# EAGLE design Mini-32BOT Rev.A (EAGLE 9.5.2)
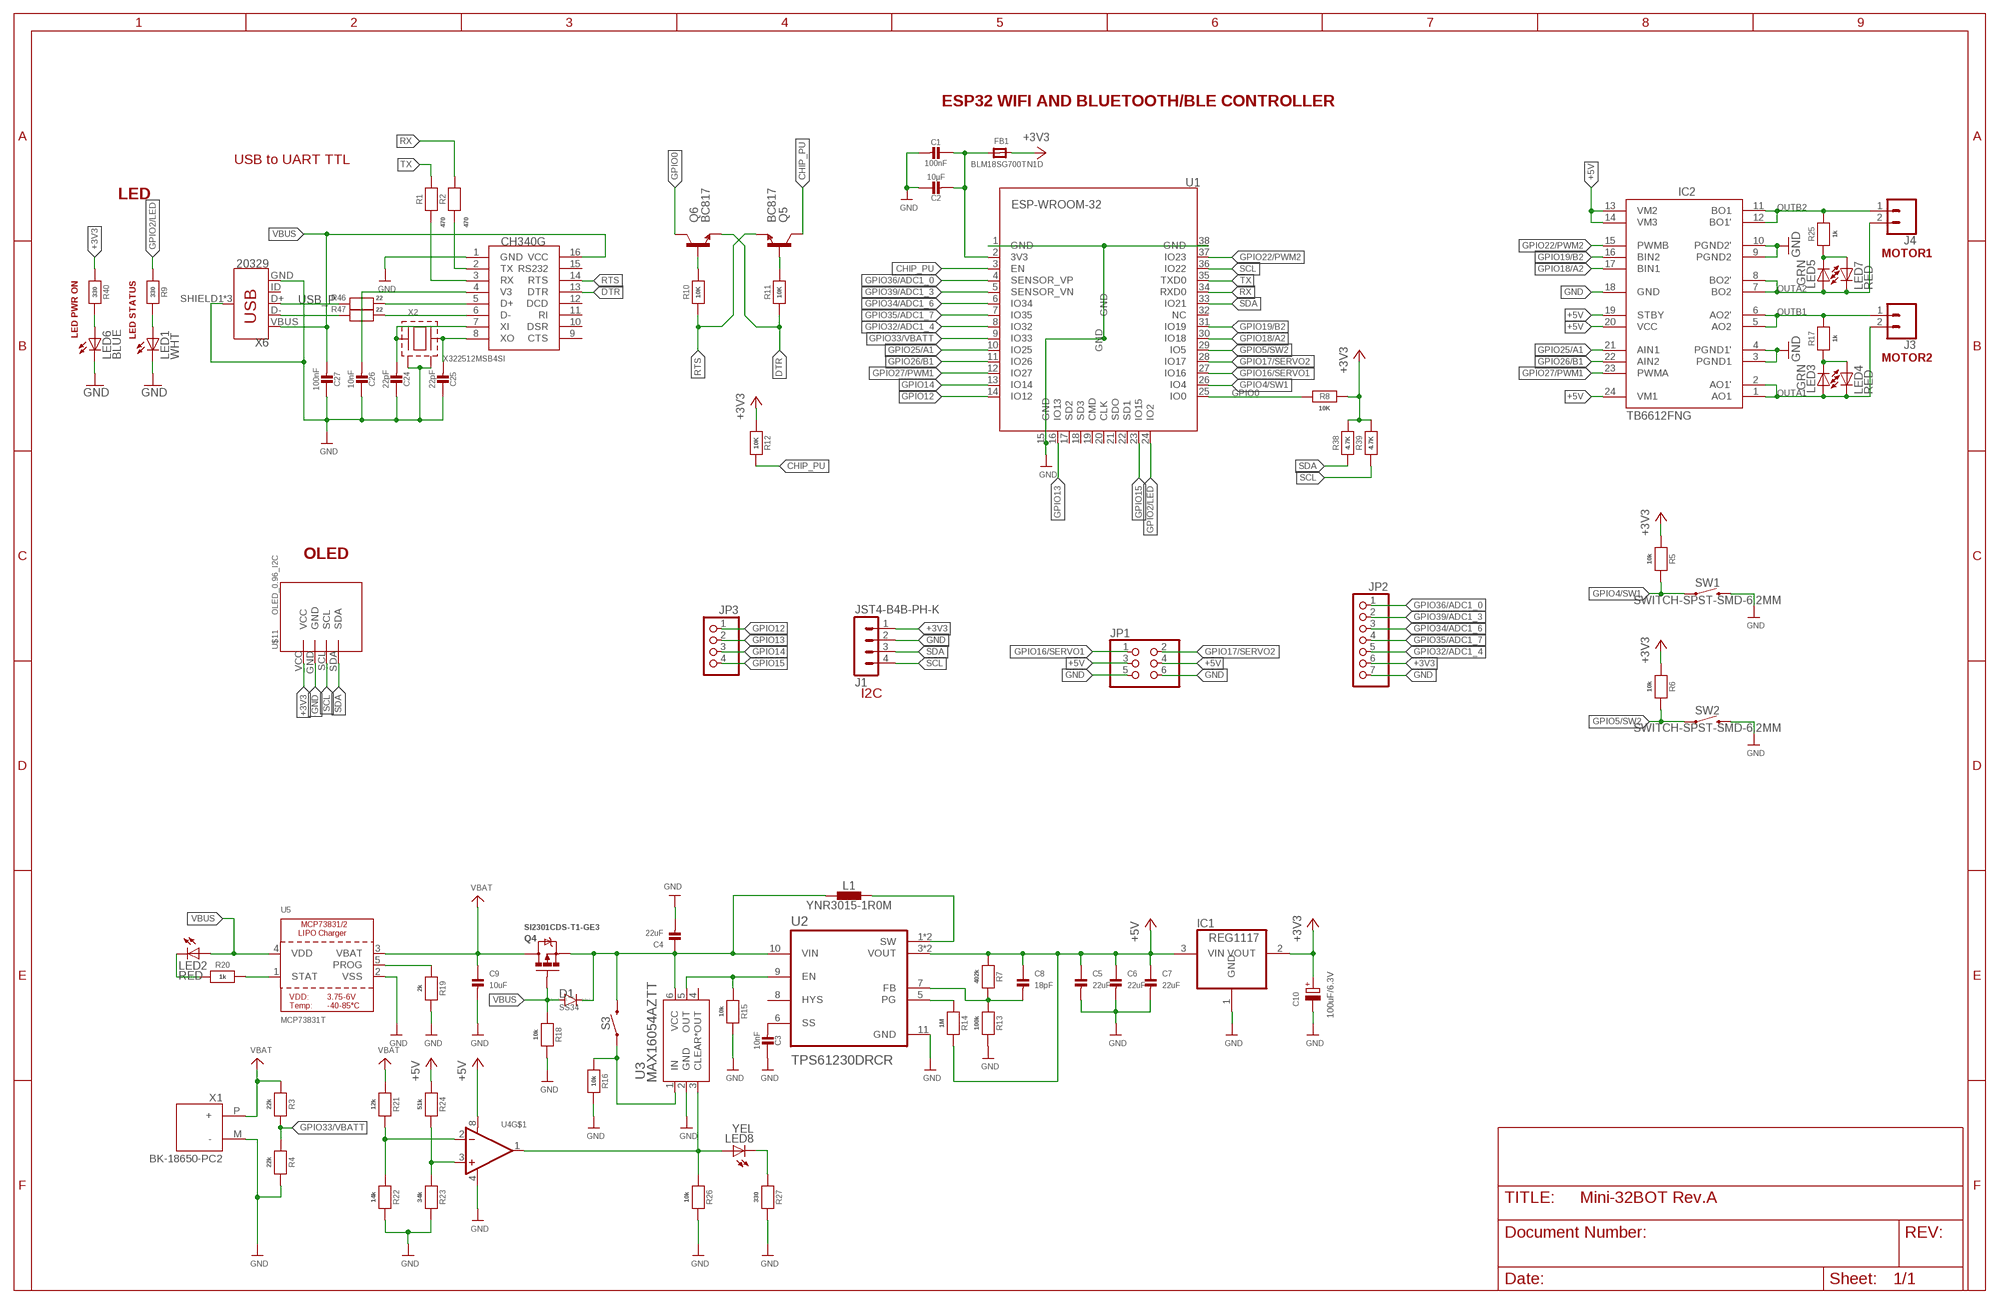
[diagram p0: schematic, sheet 1]

## Parts
C1  100nF  CAP_CERAMIC0603  [0603]
C2  10µF  CAP_CERAMIC0805  [0805]
C3  10nF  CAP_CERAMIC0603  [0603]
C4  22uF  CAP_CERAMIC0805  [0805]
C5  22uF  CAP_CERAMIC0805  [0805]
C6  22uF  CAP_CERAMIC0805  [0805]
C7  22uF  CAP_CERAMIC0805  [0805]
C8  18pF  CAP_CERAMIC0603  [0603]
C9  10uF  CAP_CERAMIC0805  [0805]
C10  100uF/6.3V  CPOL-EUCT3528  [CT3528]
C24  22pF  CAP_CERAMIC0603  [0603]
C25  22pF  CAP_CERAMIC0603  [0603]
C26  10nF  CAP_CERAMIC0603  [0603]
C27  100nF  CAP_CERAMIC0603  [0603]
D1  SS34  DIODE-DO-214AC  [DO-214AC]
FB1  BLM18SG700TN1D  FERRITE_0603  [_0603]
IC1  REG1117  [SOT223]
IC2  TB6612FNG  [SSOP24]
J1  JST4-B4B-PH-K  [JST_B4B-PH-K]
J3  CONN_023.5MM  [SCREWTERMINAL-3.5MM-2]
J4  CONN_023.5MM  [SCREWTERMINAL-3.5MM-2]
JP1  PINHD-2X03_2.54  [2X03]
JP2  PINHD-1X07_2.54-S  [1X07-S]
JP3  PINHD-1X04_2.54-S  [1X04-S]
L1  YNR3015-1R0M  INDUCTOR-NR40XX  [L_NR40XX]
LED1  WHT  LEDCHIP-LED0805  [CHIP-LED0805]
LED2  RED  LEDCHIP-LED0805  [CHIP-LED0805]
LED3  GRN  LEDCHIP-LED0805  [CHIP-LED0805]
LED4  RED  LEDCHIP-LED0805  [CHIP-LED0805]
LED5  GRN  LEDCHIP-LED0805  [CHIP-LED0805]
LED6  BLUE  LEDCHIP-LED0805  [CHIP-LED0805]
LED7  RED  LEDCHIP-LED0805  [CHIP-LED0805]
LED8  YEL  LEDCHIP-LED0805  [CHIP-LED0805]
Q4  SI2301CDS-T1-GE3  MOSFET-PCHANNELDMG2307L  [SOT23-3]
Q5  BC817  TRANSISTOR_NPNSOT23-3  [SOT23-3]
Q6  BC817  TRANSISTOR_NPNSOT23-3  [SOT23-3]
R1  470  RESISTOR0603  [0603]
R2  470  RESISTOR0603  [0603]
R3  22k  RESISTOR0603  [0603]
R4  22k  RESISTOR0603  [0603]
R5  10k  RESISTOR0603  [0603]
R6  10k  RESISTOR0603  [0603]
R7  402k  RESISTOR0603  [0603]
R8  10K  RESISTOR0603  [0603]
R9  330  RESISTOR0603  [0603]
R10  10K  RESISTOR0603  [0603]
R11  10K  RESISTOR0603  [0603]
R12  10K  RESISTOR0603  [0603]
R13  100k  RESISTOR0603  [0603]
R14  1M  RESISTOR0603  [0603]
R15  10k  RESISTOR0603  [0603]
R16  10k  RESISTOR0603  [0603]
R17  1k  RESISTOR0603  [0603]
R18  10k  RESISTOR0603  [0603]
R19  2k  RESISTOR0603  [0603]
R20  1k  RESISTOR0603  [0603]
R21  12k  RESISTOR0603  [0603]
R22  14k  RESISTOR0603  [0603]
R23  34k  RESISTOR0603  [0603]
R24  51k  RESISTOR0603  [0603]
R25  1k  RESISTOR0603  [0603]
R26  10k  RESISTOR0603  [0603]
R27  330  RESISTOR0603  [0603]
R38  4.7K  RESISTOR0603  [0603]
R39  4.7K  RESISTOR0603  [0603]
R40  330  RESISTOR0603  [0603]
R46  22  RESISTOR0603  [0603]
R47  22  RESISTOR0603  [0603]
S3  MOMENTARY-SWITCH-SPST-PTH-RIGHT-ANGLE-KIT  [TACTILE_SWITCH_PTH_RIGHT_ANGLE_KIT]
SW1  SWITCH-SPST-SMD-6.2MM  MOMENTARY-SWITCH-SPST-SMD-6.2MM-TALL  [TACTILE_SWITCH_SMD_6.2MM_TALL]
SW2  SWITCH-SPST-SMD-6.2MM  MOMENTARY-SWITCH-SPST-SMD-6.2MM-TALL  [TACTILE_SWITCH_SMD_6.2MM_TALL]
U1  ESP-WROOM-32  [ESP-WROOM-32]
U2  TPS61230DRCR  [SON50P300X300X100-11N]
U3  MAX16054AZTT  [21-0114C]
U4  LM358  [SOIC8_150MIL]
U5  MCP73831T  MCP73831/2  [SOT23-5]
U$11  OLED_0.96_I2C  [OLED_0.96_I2C]
U$24  CH340G  [SOIC16]
X1  BK-18650-PC2  [MPD_BK-18650-PC2]
X2  X322512MSB4SI  306010049_XTAL_16MHZ-3225_4P  [X3225_4P]
X6  20329  USB_MICRO-B_FEMALE-SMT  [USB-B-MICRO-SMD]

## Nets
3V3: C1.1 C2.2 FB1.1 U1.2(3V3)
+3V3: C10.+ FB1.2 IC1.2(VOUT) J1.1 JP2.6 R5.1 R6.1 R8.2 R12.1 R38.2 R39.2 R40.1 U$11.VCC
+5V: C5.1 C6.1 C7.1 C8.1 IC1.3(VIN) IC2.13(VM2) IC2.14(VM3) IC2.19(STBY) IC2.20(VCC) IC2.24(VM1) JP1.3 JP1.4 R7.1 R14.2 R24.1 U2.3(VOUT) U2.4(VOUT) U4.8(V+)
CHIP_PU: Q5.3(C) R12.2 U1.3(EN)
DTR: Q6.2(E) R11.1 U$24.13(DTR)
GND: C1.2 C2.1 C3.1 C4.2 C5.2 C6.2 C7.2 C9.2 C10.- C24.1 C25.1 C26.1 C27.1 IC1.1(GND) IC2.3(PGND1) IC2.4(PGND1') IC2.9(PGND2) IC2.10(PGND2') IC2.18(GND) J1.2 JP1.5 JP1.6 JP2.7 LED1.C LED6.C R4.2 R13.2 R15.2 R16.2 R18.2 R19.2 R22.2 R23.2 R26.2 R27.2 SW1.B2 SW2.B2 U1.1(GND) U1.15(GND) U1.38(GND) U1.GND U2.11(GND) U3.2(GND) U4.4(V-) U5.2(VSS) U$11.GND U$24.1(GND) X1.M(-) X2.P$2(GND1) X2.P$4(GND2) X6.GND X6.SHIELD1(SHIELD) X6.SHIELD2(SHIELD) X6.SHIELD3(SHIELD)
GPIO0: Q6.3(C) R8.1 U1.25(IO0)
GPIO2/LED: R9.1 U1.24(IO2)
GPIO4/SW1: R5.2 SW1.A2 U1.26(IO4)
GPIO5/SW2: R6.2 SW2.A2 U1.29(IO5)
GPIO12: JP3.1 U1.14(IO12)
GPIO13: JP3.2 U1.16(IO13)
GPIO14: JP3.3 U1.13(IO14)
GPIO15: JP3.4 U1.23(IO15)
GPIO16/SERVO1: JP1.1 U1.27(IO16)
GPIO17/SERVO2: JP1.2 U1.28(IO17)
GPIO18/A2: IC2.17(BIN1) U1.30(IO18)
GPIO19/B2: IC2.16(BIN2) U1.31(IO19)
GPIO22/PWM2: IC2.15(PWMB) U1.37(IO23)
GPIO25/A1: IC2.21(AIN1) U1.10(IO25)
GPIO26/B1: IC2.22(AIN2) U1.11(IO26)
GPIO27/PWM1: IC2.23(PWMA) U1.12(IO27)
GPIO32/ADC1_4: JP2.5 U1.8(IO32)
GPIO33/VBATT: R3.2 R4.1 U1.9(IO33)
GPIO34/ADC1_6: JP2.3 U1.6(IO34)
GPIO35/ADC1_7: JP2.4 U1.7(IO35)
GPIO36/ADC1_0: JP2.1 U1.4(SENSOR_VP)
GPIO39/ADC1_3: JP2.2 U1.5(SENSOR_VN)
N$1: C4.1 D1.C L1.1 Q4.2(S) S3.2 U2.10(VIN) U3.6(VCC)
N$2: C3.2 U2.6(SS)
N$3: L1.2 U2.1(SW) U2.2(SW)
N$4: R15.1 U2.9(EN) U3.5(OUT)
N$5: C8.2 R7.2 R13.1 U2.7(FB)
N$6: R14.1 U2.5(PG)
N$7: R16.1 S3.1 U3.1(IN)
N$8: R21.2 R22.1 U4.2(-IN)
N$9: R23.1 R24.2 U4.3(+IN)
N$10: LED8.A R26.1 U3.3(CLEAR) U4.1(OUT)
N$11: LED3.C LED4.A R17.1
N$12: LED5.C LED7.A R25.1
N$13: R19.1 U5.5(PROG)
N$14: C25.2 U$24.8(XO) X2.P$3
N$15: LED2.C R20.1
N$16: R20.2 U5.1(STAT)
N$17: C24.2 U$24.7(XI) X2.P$1
N$22: LED8.C R27.1
N$23: LED1.A R9.2
N$35: LED6.A R40.2
N$38: Q5.1(B) R11.2
N$40: C26.2 U$24.4(V3)
N$41: Q6.1(B) R10.2
N$52: R2.1 U$24.2(TX)
N$53: R1.1 U$24.3(RX)
N$64: R46.1 U$24.5(D+)
N$65: R47.1 U$24.6(D-)
OUTA1: IC2.1(AO1) IC2.2(AO1') J3.2 LED3.A LED4.C
OUTA2: IC2.7(BO2) IC2.8(BO2') J4.2 LED5.A LED7.C
OUTB1: IC2.5(AO2) IC2.6(AO2') J3.1 R17.2
OUTB2: IC2.11(BO1) IC2.12(BO1') J4.1 R25.2
RTS: Q5.2(E) R10.1 U$24.14(RTS)
RX: R2.2 U1.34(RXD0)
SCL: J1.4 R39.1 U1.36(IO22) U$11.SCL
SDA: J1.3 R38.1 U1.33(IO21) U$11.SDA
TX: R1.2 U1.35(TXD0)
USB_N: R47.2 X6.D-
USB_P: R46.2 X6.D+
VBAT: C9.1 Q4.3(D) R3.1 R21.1 U5.3(VBAT) X1.P(+)
VBUS: C27.2 D1.A LED2.A Q4.1(G) R18.1 U5.4(VDD) U$24.16(VCC) X6.VBUS
Unconnected: U1.17(SD2) U1.18(SD3) U1.19(CMD) U1.20(CLK) U1.21(SDO) U1.22(SD1) U1.32(NC) U2.8(HYS) U3.4(*OUT) U4.5(+IN) U4.6(-IN) U4.7(OUT) U$24.9(CTS) U$24.10(DSR) U$24.11(RI) U$24.12(DCD) U$24.15(RS232) X6.ID

## Notes on the sheet
- ESP32 WIFI AND BLUETOOTH/BLE CONTROLLER
- USB to UART TTL
- LED
- MOTOR1
- LED PWR ON | LED STATUS
- MOTOR2
- OLED
- I2C

## Library data of the parts
C1-C9 C24-C27 = microbuilder:CAP_CERAMIC: Ceramic Capacitors 0402 - 0402 Surface Mount Capacitors 16pF 50V 5% [Digikey: 445-4899-2-ND] 18pF 50V 5% [Digikey: 490-1281-2-ND] 22pF 50V 5% [Digikey: 490-1283-2-ND] 68pF 50V 5% [Digikey: 490-1289-2-ND] 0.1uF 10V 10% [Digikey: 490-1318-2-ND] 1.0uF 6.3V 10% [Digikey: 490-1320-2-ND] 0603 - 0603 Surface Mount Capacitors 16 pF 50V 5% [Digikey: 445-5051-2-ND] 22 pF 50V [Digikey: PCC220ACVTR-ND] 33 pF 50V 5% [Digikey: 490-1415-1-ND] 56pF 50V 5% [Digikey: 490-1421-1-ND] 220pF 50V 5% [Digikey: 445-1285-1-ND] 680 pF 50V 2200 pF 50V 5% C0G [Digikey: 445-1297-1-ND] 5600 pF 100V 5% X7R [Digikey: 478-3711-1-ND] 0.1 µF 25V 10% [Digikey: PCC2277TR-ND] 0.22 µF 16V 10% X7R [Digikey: 445-1318-1-ND] 1.0 µF 25V 10% [Digikey: 445-5146-2-ND] 0603 - RF Specific 3pF 250V +/-0.1pF RF [Digikey: 712-1347-1-ND] 18 pF 250V 5% [Digikey: 478-3505-1-ND or 712-1322-1-ND] 56 pF 250V 5% C0G RF [Digikey: 490-4867-1-ND] 68 pF 250V RF [Digikey: 490-4868-1-ND] 0805 - 0805 Surface Mount Capacitors 220 pF 250V 2% RF Ceramic Capacitor [Digikey: 712-1398-1-ND] 1000 pF 50V 2% NP0 Ceramic Capacitor [Digikey: 478-3760-1-ND] 0.1 µF 25V 10% Ceramic Capacitor [Digikey: PCC1828TR-ND] 1.0 µF 16V 10% Ceramic Capacitor[Digikey: 490-1691-2-ND] 10.0 µF 10V 10% Ceramic Capacitor[Digikey: 709-1228-1-ND] 10.0 uF 16V 10% Ceramic Capacitor [Digikey: 478-5165-2-ND] 47 uF 6.3V 20% Ceramic Capacitor [Digikey: 587-1779-1-ND or 399-5506-1-ND] 1206 - 1206 Surface Mount Capacitors 47uF 10V 20% Ceramic Capacitor [Digikey: 490-5528-1-ND or 399-5508-1-ND or 445-6010-1-ND] 100uF 6.3V -20%, +80% Y5V Ceramic Capacitor (Digikey: 490-4512-1-ND, Mouser: 81-GRM31CF50J107ZE1L)
C10 = rcl:CPOL-EU: POLARIZED CAPACITOR, European symbol; SPICEPREFIX: C
D1 = diode:DIODE-: DIODE
FB1 = microbuilder:FERRITE: Ferrite Bead 0603 MMZ1608B121C - 120 Ohm @ 100MHz, 600mA, 0.15 Ohm DC Resistance - Digikey: 445-2164-1-ND BK1608HW121-T - 120 Ohm, 600mA Ferrite Chip - Digikey: 587-1876-2-ND 0805 HZ0805B272R-10 - 2.7K Ohm @ 100MHz, 200mA, 0.8 Ohm DC Resistance - Digikey: 240-2504-1-ND (see also Murata BLM21BD272SN1L) MMZ2012Y152B - 1.5K Ohm @ 100MHz, 500mA, 0.4 Ohm DC Resistance - Digikey: 445-1560-1-ND - Mainly for high frequency (80-400MHz) MMZ2012R102A - 1K Ohm @ 100MHz, 500mA, 0.3 Ohm DC Resistance - Digikey: 445-1555-2-ND - More general purpose (10-200MHz)
IC1 = burr-brown:REG1117: 800mA and 1A Low Dropout (LDO) Positive Regulator 1.8V, 2.5V, 2.85V, 3.3V, 5V, and Adj; MPN: REG1117; OC_FARNELL: 1097566; OC_NEWARK: 14P6981
IC2 = adafruit:TB6612FNG: TB6612FNG MOS dual H-bridge motor driver, 1.2A current 3.2A peak 3 or 5v logic and 3-15v motor
J1 = we-con:JST4: JST Connector
J3 J4 = SparkFun-Retired:CONN_02: Multi connection point. Often used as Generic Header-pin footprint for 0.1 inch spaced/style header connections On any of the 0.1 inch spaced packages, you can populate with these: Break Away Headers - Straight <https://www.sparkfun.com/products/116> (PRT-00116) Break Away Male Headers - Right Angle <https://www.sparkfun.com/products/553> (PRT-00553) Female Headers <https://www.sparkfun.com/products/115> (PRT-00115) Break Away Headers - Machine Pin <https://www.sparkfun.com/products/117> (PRT-00117) Break Away Female Headers - Swiss Machine Pin <https://www.sparkfun.com/products/743> (PRT-00743) For SCREWTERMINALS and SPRING TERMINALS visit here: Screw Terimnals on SparkFun.com <https://www.sparkfun.com/search/results?term=Screw+Terminals> (5mm/3.5mm/2.54mm spacing) This device is also useful as a general connection point to wire up your design to another part of your project. Our various solder wires solder well into these plated through hole pads. Hook-Up Wire - Assortment (Stranded, 22 AWG) <https://www.sparkfun.com/products/11375> (PRT-11375) Hook-Up Wire - Assortment (Solid Core, 22 AWG) <https://www.sparkfun.com/products/11367> (PRT-11367) View the entire wire category on our website here <https://www.sparkfun.com/categories/141> Special notes: Molex polarized connector foot print use with: PRT-08233 with associated crimp pins and housings. 2.54_SCREWTERM for use with PRT-10571. 3.5mm Screw Terminal footprints for PRT-08084 5mm Screw Terminal footprints for use with PRT-08432; PROD_ID: CONN-08399
JP1 = pinhead-2:PINHD-2X03: PIN HEADER
JP2 = pinhead-2:PINHD-1X07: PIN HEADER
JP3 = pinhead-2:PINHD-1X04: PIN HEADER
L1 = we-power:INDUCTOR: Power Inductor Taiyo Yuden NR4018 NR4018T1R0N - 1.0uH, Ir=4.0A NR4018T2R2N - 2.2uH, Ir=2.7A NR4018T3R3N - 3.3uH, Ir=2.0A NR4018T4R5N - 4.7uH, Ir=1.7A NR4018T6R8N - 6.8uH, Ir=1.4A NR4018T100M - 10uH, Ir=1.2A NR4018T150M - 15uH, Ir=0.94A NR4018T220M - 22uH, Ir=0.80A NR4018T330M - 33uH, Ir=0.65A NR4018T470M - 47uH, Ir=0.57A NR4018T680M - 68uH, Ir=0.47A NR4018T101M - 100uH, Ir=0.40A Taiyo Yuden NR6028 NR6028T0R9N - 0.9uH, Ir=6.6A NR6028T1R5N - 1.5uH, Ir=5.0A NR6028T2R2N - 2.2uH, Ir=4.2A NR6028T3R0N - 3.0uH, Ir=3.6A NR6028T4R7M - 4.7uH, Ir=2.7A NR6028T6R0M - 6.0uH, Ir=2.5A NR6028T100M - 10uH, Ir=1.9A NR6028T150M - 15uH, Ir=1.6A NR6028T220M - 22uH, Ir=1.3A NR6028T330M - 33uH, Ir=1.1A NR6028T470M - 47uH, Ir=0.95A NR6028T680M - 68uH, Ir=0.76A NR6028T101M - 100uH, Ir=0.62A Taiyo Yuden NR6045 NR6045T1R0N - 1.0uH, Ir=8.5A NR6045T1R3N - 1.3uH, Ir=8.0A NR6045T1R8N - 1.8uH, Ir=7.0A NR6045T2R3N - 2.3uH, Ir=6.0A NR6045T3R0N - 3.0uH, Ir=5.0A NR6045T4R5M - 4.5uH, Ir=4.0A NR6045T6R3M - 6.3uH, Ir=3.8A NR6045T100M - 10uH, Ir=3.0A NR6045T150M - 15uH, Ir=2.3A NR6045T220M - 22uH, Ir=1.9A NR6045T330M - 33uH, Ir=1.5A NR6045T470M - 47uH, Ir=1.3A NR6045T680M - 68uH, Ir=1.0A NR6045T101M - 100uH, Ir=0.8A
LED1-LED8 = led:LED: LED OSRAM: - CHIPLED LG R971, LG N971, LY N971, LG Q971, LY Q971, LO R971, LY R971 LH N974, LH R974 LS Q976, LO Q976, LY Q976 LO Q996 - Hyper CHIPLED LW Q18S LB Q993, LB Q99A, LB R99A - SideLED LS A670, LO A670, LY A670, LG A670, LP A670 LB A673, LV A673, LT A673, LW A673 LH A674 LY A675 LS A676, LA A676, LO A676, LY A676, LW A676 LS A679, LY A679, LG A679 - Hyper Micro SIDELED® LS Y876, LA Y876, LO Y876, LY Y876 LT Y87S - SmartLED LW L88C, LW L88S LB L89C, LB L89S, LG L890 LS L89K, LO L89K, LY L89K LS L896, LA L896, LO L896, LY L896 - TOPLED LS T670, LO T670, LY T670, LG T670, LP T670 LSG T670, LSP T670, LSY T670, LOP T670, LYG T670 LG T671, LOG T671, LSG T671 LB T673, LV T673, LT T673, LW T673 LH T674 LS T676, LA T676, LO T676, LY T676, LB T676, LH T676, LSB T676, LW T676 LB T67C, LV T67C, LT T67C, LS T67K, LO T67K, LY T67K, LW E67C LS E67B, LA E67B, LO E67B, LY E67B, LB E67C, LV E67C, LT E67C LW T67C LS T679, LY T679, LG T679 LS T770, LO T770, LY T770, LG T770, LP T770 LB T773, LV T773, LT T773, LW T773 LH T774 LS E675, LA E675, LY E675, LS T675 LS T776, LA T776, LO T776, LY T776, LB T776 LHGB T686 LT T68C, LB T68C - Hyper Mini TOPLED® LB M676 - Mini TOPLED Santana® LG M470 LS M47K, LO M47K, LY M47K Source: http://www.osram.convergy.de LUXEON: - LUMILED® LXK2-PW12-R00, LXK2-PW12-S00, LXK2-PW14-U00, LXK2-PW14-V00 LXK2-PM12-R00, LXK2-PM12-S00, LXK2-PM14-U00 LXK2-PE12-Q00, LXK2-PE12-R00, LXK2-PE12-S00, LXK2-PE14-T00, LXK2-PE14-U00 LXK2-PB12-K00, LXK2-PB12-L00, LXK2-PB12-M00, LXK2-PB14-N00, LXK2-PB14-P00, LXK2-PB14-Q00 LXK2-PR12-L00, LXK2-PR12-M00, LXK2-PR14-Q00, LXK2-PR14-R00 LXK2-PD12-Q00, LXK2-PD12-R00, LXK2-PD12-S00 LXK2-PH12-R00, LXK2-PH12-S00 LXK2-PL12-P00, LXK2-PL12-Q00, LXK2-PL12-R00 Source: www.luxeon.com KINGBRIGHT: KA-3528ASYC Source: www.kingbright.com
Q4 = SparkFun-DiscreteSemi:MOSFET-PCHANNEL: Generic PMOSFET IRLML2244 - TRANS-11153 (SOT-23 -20V -4.3A) (1.Gate 2.Source 3.Drain) FQP27P06 - COM-10349 <http://www.sparkfun.com/products/10349> (TO-220 -60V -27A) (1.Gate 2.Source 3.Drain); PROD_ID: TRANS-11308; VALUE: 2.5A/30V
Q5 Q6 = SparkFun:TRANSISTOR_NPN: Transistor NPN BJT configuration in SOT23 package. MMBT2222 is the common NPN we use. Double check BCE configuration again layout.
R1-R27 R38-R40 R46 R47 = microbuilder:RESISTOR: Resistors 0402 - 0402 Surface Mount Package 22 Ohm 1% 1/16W [Digikey: 311-22.0LRTR-ND] 33 Ohm 5% 1/16W 1.0K 5% 1/16W 1.5K 5% 1/16W 2.0K 1% 1/16W 10.0K 1% 1/16W [Digikey: 311-10.0KLRTR-ND] 10.0K 5% 1/16W [Digikey: RMCF0402JT10K0TR-ND] 12.1K 1% 1/16W [Digikey: 311-22.0LRTR-ND] 100.0K 5% 1/16W 0603 - 0603 Surface Mount Package 0 Ohm 1/10 Watt 1% Resistor 15 Ohm 1/10 Watt 1% Resistor 33 Ohm 1/10 Watt 1% Resistor 49.9 Ohm 1/10 Watt 1% Resistor 100 Ohm 1/10 Watt 1% Resistor 150 Ohm 1/10 Watt 1% Resistor 240 Ohm 1/10 Watt 1% Resistor 390 Ohm 1/10 Watt 1% Resistor 560 Ohm 1/10 Watt 1% Resistor 680 Ohm 1/10 Watt 1% Resistor 750 Ohm 1/10 Watt 1% Resistor 1.0K Ohm 1/10 Watt 1% Resistor 1.5K Ohm 1/10 Watt 1% Resistor 2.0K Ohm 1/10 Watt 1% Resistor 2.2K Ohm 1/10 Watt 1% Resistor 3.3K Ohm 1/10 Watt 1% Resistor 4.7K Ohm 1/10 Watt 1% Resistor 10.0K Ohm 1/10 Watt 1% Resistor 12.0K Ohm 1/10 Watt 1% Resistor 12.1K Ohm 1/10 Watt 1% Resistor 20.0K Ohm 1/10 Watt 1% Resistor 33.0K Ohm 1/10 Watt 1% Resistor 100.0K Ohm 1/10 Watt 1% Resistor 0805 - 0805 Surface Mount Package 0 Ohm 1/8 Watt 1% Resistor 33 Ohm 1/8 Watt 1% Resistor 100 Ohm 1/8 Watt 1% Resistor 150 Ohm 1/8 Watt 1% Resistor 200 Ohm 1/8 Watt 1% Resistor 240 Ohm 1/8 Watt 1% Resistor 330 Ohm 1/8 Watt 1% Resistor 390 Ohm 1/8 Watt 1% Resistor 470 Ohm 1/8 Watt 1% Resistor 1.0K Ohm 1/8 Watt 1% Resistor 1.5K Ohm 1/8 Watt 1% Resistor 2.0K Ohm 1/8 Watt 1% Resistor 4.7K Ohm 1/8 Watt 1% Resistor 5.1K Ohm 1/8 Watt 1% Resistor 5.6K Ohm 1/8 Watt 1% Resistor 10.0K Ohm 1/8 Watt 1% Resistor 22.0K Ohm 1/8 Watt 1% Resistor 33.0K Ohm 1/8 Watt 1% Resistor 100K Ohm 1/8 Watt 1% Resistor 1206 - 1206 Surface Mount Package 2012 - 2010 Surface Mount Package 0.11 Ohm 1/2 Watt 1% Resistor - Digikey: RHM.11UCT-ND
S3 = SparkFun-Switches:MOMENTARY-SWITCH-SPST: Momentary Switch (Pushbutton) - SPST Normally-open (NO) SPST momentary switches (buttons, pushbuttons). Variants PTH-12MM - 12mm square, through-hole Momentary Pushbutton Switch - 12mm Square <https://www.sparkfun.com/products/9190> (COM-09190) PTH-6.0MM, PTH-6.0MM-KIT - 6.0mm square, through-hole Mini Pushbutton Switch <https://www.sparkfun.com/products/97> (COM-00097) KIT package intended for soldering kit's - only one side of pads' copper is exposed. PTH-RIGHT-ANGLE-KIT - Right-angle, through-hole Right Angle Tactile Button <https://www.sparkfun.com/products/10791> - Used on SparkFun BigTime Watch Kit <https://www.sparkfun.com/products/11734> SMD-12MM - 12mm square, surface-mount Tactile Button - SMD (12mm) <https://www.sparkfun.com/products/12993> (COM-12993) Used on SparkFun PicoBoard <https://www.sparkfun.com/products/11888> SMD-4.5MM - 4.5mm Square Trackball Switch Used on SparkFun Blackberry Trackballer Breakout <https://www.sparkfun.com/products/13169> SMD-4.6MMX2.8MM - 4.60mm x 2.80mm, surface mount Used on SparkFun SAMD21 Mini Breakout <https://www.sparkfun.com/products/13664> SMD-5.2MM, SMD-5.2-REDUNDANT - 5.2mm square, surface-mount Mini Pushbutton Switch - SMD <https://www.sparkfun.com/products/8720> (COM-08720) Used on Arduino Pro Mini <https://www.sparkfun.com/products/11114> REDUNDANT package connects both switch circuits together SMD-6.0X3.5MM - 6.0 x 3.5mm, surface mount Momentary Reset Switch SMD <https://www.sparkfun.com/products/8229> (COM-08229) SMD-6.2MM-TALL - 6.2mm square, surface mount Tactile Button - SMD (6mm) <https://www.sparkfun.com/products/12992> Used on SparkFun Digital Sandbox <https://www.sparkfun.com/products/12651> SMD-RIGHT-ANGLE - Right-angle, surface mount Used on SparkFun Block for Intel® Edison - Arduino <https://www.sparkfun.com/products/13036>; PROD_ID: CONN-10672; SF_SKU: COM-10791
SW1 SW2 = SparkFun-Switches:MOMENTARY-SWITCH-SPST: Momentary Switch (Pushbutton) - SPST Normally-open (NO) SPST momentary switches (buttons, pushbuttons). Variants PTH-12MM - 12mm square, through-hole Momentary Pushbutton Switch - 12mm Square <https://www.sparkfun.com/products/9190> (COM-09190) PTH-6.0MM, PTH-6.0MM-KIT - 6.0mm square, through-hole Mini Pushbutton Switch <https://www.sparkfun.com/products/97> (COM-00097) KIT package intended for soldering kit's - only one side of pads' copper is exposed. PTH-RIGHT-ANGLE-KIT - Right-angle, through-hole Right Angle Tactile Button <https://www.sparkfun.com/products/10791> - Used on SparkFun BigTime Watch Kit <https://www.sparkfun.com/products/11734> SMD-12MM - 12mm square, surface-mount Tactile Button - SMD (12mm) <https://www.sparkfun.com/products/12993> (COM-12993) Used on SparkFun PicoBoard <https://www.sparkfun.com/products/11888> SMD-4.5MM - 4.5mm Square Trackball Switch Used on SparkFun Blackberry Trackballer Breakout <https://www.sparkfun.com/products/13169> SMD-4.6MMX2.8MM - 4.60mm x 2.80mm, surface mount Used on SparkFun SAMD21 Mini Breakout <https://www.sparkfun.com/products/13664> SMD-5.2MM, SMD-5.2-REDUNDANT - 5.2mm square, surface-mount Mini Pushbutton Switch - SMD <https://www.sparkfun.com/products/8720> (COM-08720) Used on Arduino Pro Mini <https://www.sparkfun.com/products/11114> REDUNDANT package connects both switch circuits together SMD-6.0X3.5MM - 6.0 x 3.5mm, surface mount Momentary Reset Switch SMD <https://www.sparkfun.com/products/8229> (COM-08229) SMD-6.2MM-TALL - 6.2mm square, surface mount Tactile Button - SMD (6mm) <https://www.sparkfun.com/products/12992> Used on SparkFun Digital Sandbox <https://www.sparkfun.com/products/12651> SMD-RIGHT-ANGLE - Right-angle, surface mount Used on SparkFun Block for Intel® Edison - Arduino <https://www.sparkfun.com/products/13036>; PROD_ID: SWCH-11966; SF_SKU: COM-12992
U1 = esp32:ESP-WROOM-32
U2 = TPS61230DRCR:TPS61230DRCR: High Efficiency Synchronous Boost Converter With 5-A Switch 10-VSON -40 to 85; AVAILABILITY: Unavailable; DESCRIPTION: Boost Switching Regulator IC Positive Adjustable 2.5V 1 Output 4A _Switch_ 10-VFDFN Exposed Pad; MF: Texas Instruments; MP: TPS61230DRCR; PACKAGE: VFDFN-10 Texas Instruments; PRICE: None
U3 = MAX16054AZTT:MAX16054AZTT; AVAILABILITY: Unavailable; DESCRIPTION: On/Off Controller With Debounce And +/-1; MF: Maxim Integrated; MP: MAX16054AZT+; PACKAGE: TSOT-23 Maxim Integrated; PRICE: None
U4 = microbuilder:LM358: LM358 Dual Operational Amplifier Digikey: LM358AMXFSCT-ND
U5 = microbuilder:MCP73831/2: MCP73831/2 LIPO Charger VDD: 3.75 - 6V Temp -40 - 85°C Programmable Charge Rate: 15-500mA NOTE: STAT is a tri-state logic output on the MCP73831 and an open-drain output on the MCP73832. SOT23-5 with 4.2V output and tri-state logic on STAT = MCP73831T-2ACI/OT
U$11 = tft_1.8_1.44_oled_0.96:OLED_0.96_I2C
U$24 = ch340g:CH340G
X1 = BK-18650-PC2:BK-18650-PC2: HOLDER BATT 1/LI-ION PROTECTED; AVAILABILITY: Warning; DESCRIPTION: Holder Batt 1/Li-Ion Protected; MF: MPD _Memory; MP: BK-18650-PC2; PACKAGE: DFN-14 MPD _Memory Protection Devices_; PRICE: 2.71 USD
X2 = Seeed-OPL-2017-01-Crystal-Akita:306010049_XTAL_16MHZ-3225_4P: SMD Crystal 16MHz-9pF-10ppm-40R;4P-L3.2*W2.5mm, SKU: 306010049
X6 = SparkFun-Connectors:USB_MICRO-B: USB Type Micro-B Connector Male/female and PTH/SMT variants SparkFun Products: SparkFun microB USB Breakout <https://www.sparkfun.com/products/12035> SparkFun USB microB Plug Breakout <https://www.sparkfun.com/products/10031> SparkFun ESP8266 Thing <https://www.sparkfun.com/products/13231>; PROD_ID: CONN-11752

## Board
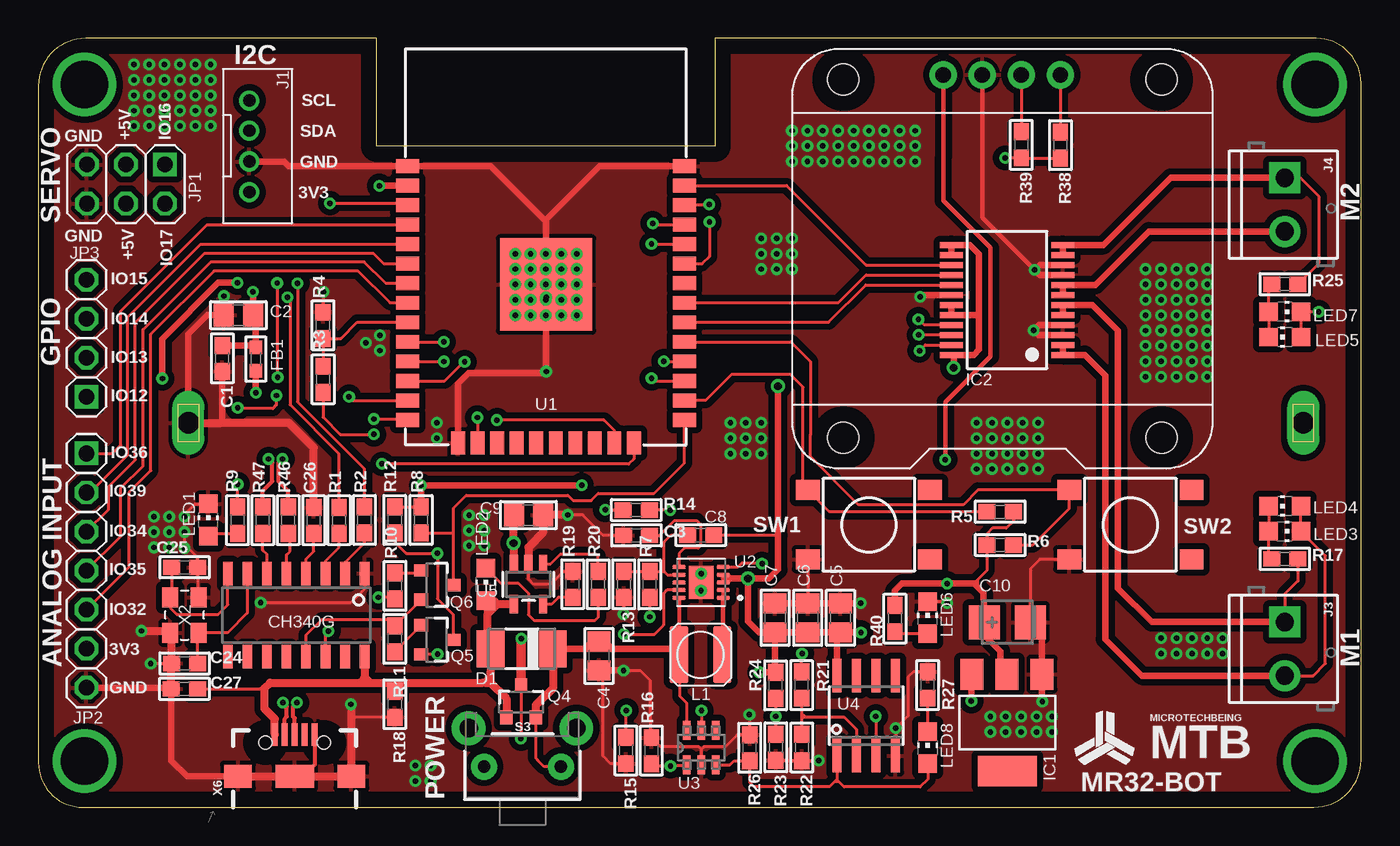
[diagram p1: board, top side]
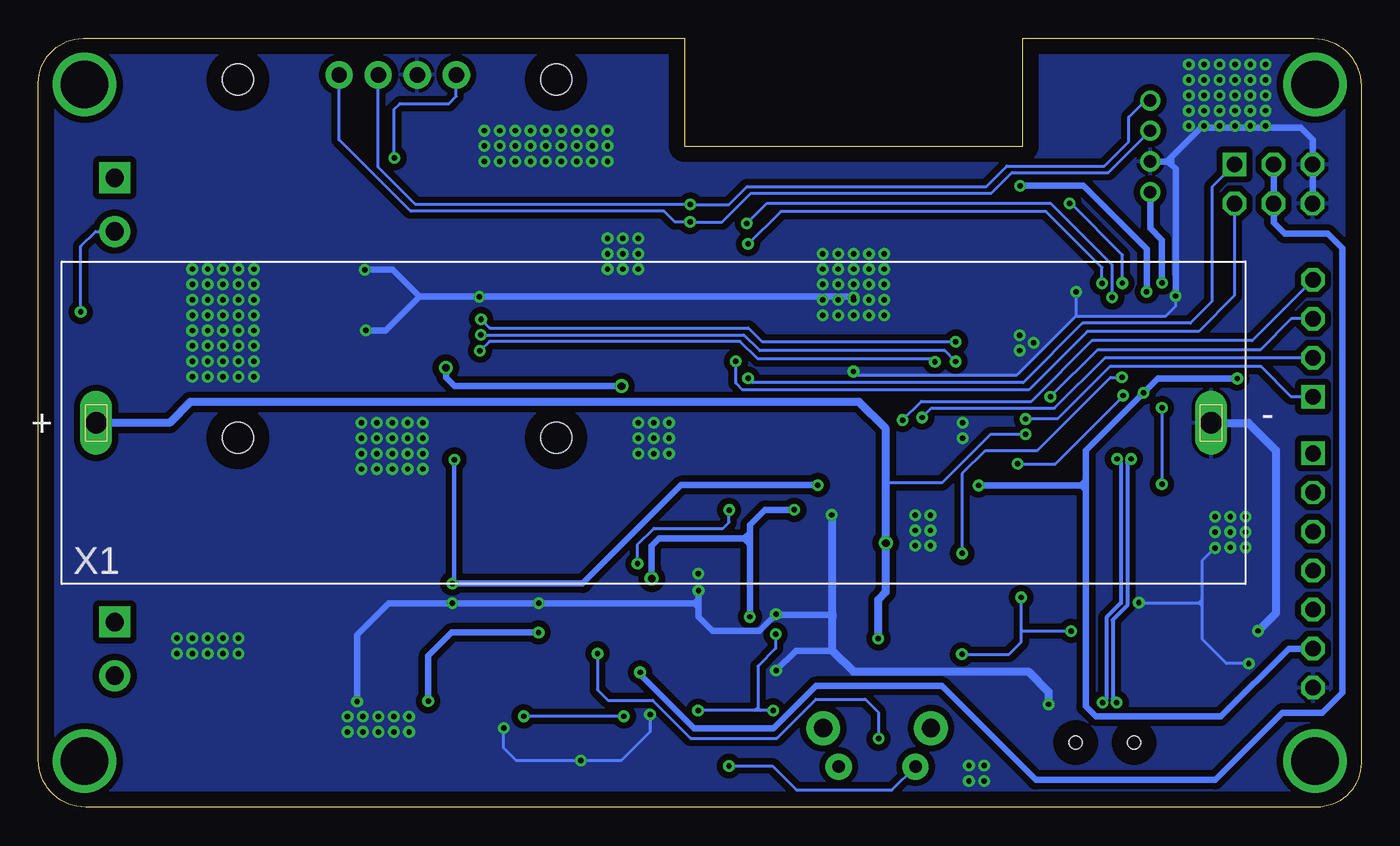
[diagram p2: board, bottom side, seen from below]

Size 86 x 50 mm. Coordinates in mm from the lower left corner, seen from the top.
Outline: 0,46.94 0,2.88 arc90 2.88,0 82.94,0 arc90 86,3.06 86,47.1 arc90 83.1,50 44,50 44,43 22,43 22,50 3.06,50 arc90 0,46.94
Copper layers (1*16): Top 0.035mm / dielectric 1.5mm / Bottom 0.035mm
Design rules "default *": minimum track width 6mil, minimum drill 0.35mm, track to track 6mil, track to pad 6mil, pad to pad 6mil, via to via 6mil, smd to smd 6mil, copper to edge 40mil, drill to drill 6mil, minimum pad ring 10mil, minimum via ring 8mil, stop-mask expansion 4mil, vias tented up to drill 15mil, thermal gap 10mil

### Footprints (pad centres in the part's own frame; a part is rotated, then mirrored left to right if it is on the bottom)
0603 = smd 1.1 x 1: 1 -0.85,0; 2 0.85,0
0805 = smd 1.3 x 1.5: 1 -0.95,0; 2 0.95,0
CT3528 = smd 2 x 2.2: + -1.5,0; - 1.5,0
DO-214AC = smd 1.8 x 2.4: A 2.025,0; C -2.025,0
_0603 = smd 0.9 x 0.8: 1 -0.762,0; 2 0.762,0
SOT223 = smd 1.499 x 2.007: 1 -2.261,-3.15; 2 0.025,-3.15; 3 2.311,-3.15 | smd 3.81 x 2.007: 4 0,3.15
SSOP24 = smd 0.4 x 1.5: 1 -3.575,-3.625; 2 -2.925,-3.625; 3 -2.275,-3.625; 4 -1.625,-3.625; 5 -0.975,-3.625; 6 -0.325,-3.625; 7 0.325,-3.625; 8 0.975,-3.625; 9 1.625,-3.625; 10 2.275,-3.625; 11 2.925,-3.625; 12 3.575,-3.625; 13 3.575,3.625; 14 2.925,3.625; 15 2.275,3.625; 16 1.625,3.625; 17 0.975,3.625; 18 0.325,3.625; 19 -0.325,3.625; 20 -0.975,3.625; 21 -1.625,3.625; 22 -2.275,3.625; 23 -2.925,3.625; 24 -3.575,3.625
JST_B4B-PH-K = drill 0.8 pad 1.3: 1 0,3; 2 0,1; 3 0,-1; 4 0,-2.96
SCREWTERMINAL-3.5MM-2 = drill 1.2 pad 2.032 square: 1 0,0 | drill 1.2 pad 2.032: 2 3.5,0
2X03 = drill 1.016 square: 1 -2.54,-1.27 | drill 1.016 octagon: 2 -2.54,1.27; 3 0,-1.27; 4 0,1.27; 5 2.54,-1.27; 6 2.54,1.27
1X07-S = drill 1.016 square: 1 -7.62,0 | drill 1.016 octagon: 2 -5.08,0; 3 -2.54,0; 4 0,0; 5 2.54,0; 6 5.08,0; 7 7.62,0
1X04-S = drill 1.016 square: 1 -3.81,0 | drill 1.016 octagon: 2 -1.27,0; 3 1.27,0; 4 3.81,0
L_NR40XX = smd 3.7 x 1.2: 1 0,1.4; 2 0,-1.4
CHIP-LED0805 = smd 1.2 x 1.2: A 0,-1.05; C 0,1.05
SOT23-3 = smd 0.8 x 0.9: 1 -0.95,-1; 2 0.95,-1; 3 0,1.1
TACTILE_SWITCH_PTH_RIGHT_ANGLE_KIT = drill 0.8 pad 1.7: 1 -2.5,0; 2 2.5,0 | drill 1.2 pad 2.2: ANCHOR1 -3.5,2.5; ANCHOR2 3.5,2.5
TACTILE_SWITCH_SMD_6.2MM_TALL = smd 1.55 x 1.3: A1 -3.975,-2.25; A2 3.975,-2.25; B1 -3.975,2.25; B2 3.975,2.25
ESP-WROOM-32 = smd 0.9 x 1.5: 1 7.7,9; 2 6.43,9; 3 5.16,9; 4 3.89,9; 5 2.62,9; 6 1.35,9; 7 0.08,9; 8 -1.19,9; 9 -2.46,9; 10 -3.73,9; 11 -5,9; 12 -6.27,9; 13 -7.54,9; 14 -8.81,9; 25 -8.81,-9; 26 -7.54,-9; 27 -6.27,-9; 28 -5,-9; 29 -3.73,-9; 30 -2.46,-9; 31 -1.19,-9; 32 0.08,-9; 33 1.35,-9; 34 2.62,-9; 35 3.89,-9; 36 5.16,-9; 37 6.43,-9; 38 7.7,-9 | smd 1.5 x 0.9: 15 -10.3,5.715; 16 -10.3,4.445; 17 -10.3,3.175; 18 -10.3,1.905; 19 -10.3,0.635; 20 -10.3,-0.635; 21 -10.3,-1.905; 22 -10.3,-3.175; 23 -10.3,-4.445; 24 -10.3,-5.715 | smd 6 x 6: GND 0,0
SON50P300X300X100-11N = smd 0.86 x 0.26: 1 -1.435,1; 2 -1.435,0.5; 3 -1.435,0; 4 -1.435,-0.5; 5 -1.435,-1; 6 1.435,-1; 7 1.435,-0.5; 8 1.435,0; 9 1.435,0.5; 10 1.435,1 | smd 1.6 x 2.15: 11 0,0
21-0114C = smd 1.219 x 0.508: 1 -1.118,0.94; 2 -1.118,0; 3 -1.118,-0.94; 4 1.118,-0.94; 5 1.118,0; 6 1.118,0.94
SOIC8_150MIL = smd 0.6 x 2.2: 1 -1.905,-2.6; 2 -0.635,-2.6; 3 0.635,-2.6; 4 1.905,-2.6; 5 1.905,2.6; 6 0.635,2.6; 7 -0.635,2.6; 8 -1.905,2.6
SOT23-5 = smd 0.55 x 1.2: 1 -0.95,-1.3; 2 0,-1.3; 3 0.95,-1.3; 4 0.95,1.3; 5 -0.95,1.3
OLED_0.96_I2C = drill 1 pad 1.778: GND -1.63,11.63; SCL 0.91,11.63; SDA 3.45,11.63; VCC -4.17,11.63 | hole 2: -10.67,-11.97; 10.03,-11.97; 10.03,11.33; -10.67,11.33
SOIC16 = smd 0.635 x 1.524: 1 -4.445,-2.695; 2 -3.175,-2.695; 3 -1.905,-2.695; 4 -0.635,-2.695; 5 0.635,-2.695; 6 1.905,-2.695; 7 3.175,-2.695; 8 4.445,-2.695; 9 4.445,2.695; 10 3.175,2.695; 11 1.905,2.695; 12 0.635,2.695; 13 -0.635,2.695; 14 -1.905,2.695; 15 -3.175,2.695; 16 -4.445,2.695
MPD_BK-18650-PC2 = drill 1.38 long: M 36.25,0; P -36.25,0
X3225_4P = smd 1.3 x 1.05: P$1 -1.15,-0.925; P$2 1.15,-0.925; P$3 1.15,0.925; P$4 -1.15,0.925
USB-B-MICRO-SMD = smd 1.45 x 0.4: D+ 2.725,0; D- 2.725,0.65; GND 2.725,-1.3; ID 2.725,-0.65; VBUS 2.725,1.3 | smd 1.5 x 1.8: SHIELD1 0,3.685; SHIELD2 0,-3.685 | smd 1.5 x 2.5: SHIELD3 0,0 | hole 0.85: 2.2,1.9; 2.2,-1.9

### Placement (x,y rotation side)
C1  11.95,29.19 270 top
C2  13,32 0 top
C3  38.89,17.68 0 top
C4  36.45,9.84 270 top
C5  52.15,12.32 90 top
C6  50.02,12.32 90 top
C7  47.9,12.32 90 top
C8  43.06,17.7 180 top
C9  31.86,19 0 top
C10  63,12.03 0 top
C24  9.5,9.35 0 top
C25  9.5,15.6 180 top
C26  17.9,18.66 270 top
C27  9.49,7.7 0 top
D1  31.42,10.31 180 top
FB1  14.13,29.15 270 top
IC1  63,5.5 180 top
IC2  62.98,32.99 90 top
J1  13.71,43 180 top
J3  81.04,12.05 270 top
J4  81.04,40.94 270 top
JP1  5.69,40.53 180 top
JP2  3.12,15.39 270 top
JP3  3.12,30.5 90 top
L1  43.06,9.92 90 top
LED1  11.04,18.68 0 top
LED2  29.09,14.5 0 top
LED3  81.04,19.59 90 top
LED4  81.04,17.94 270 top
LED5  81.04,30.58 90 top
LED6  57.81,12.33 0 top
LED7  81.04,32.23 270 top
LED8  57.82,3.88 0 top
Q4  31.38,6.84 0 top
Q5  25.89,10.89 270 top
Q6  25.89,14.45 270 top
R1  19.55,18.66 90 top
R2  21.2,18.68 90 top
R3  18.51,27.83 90 top
R4  18.5,31.34 90 top
R5  62.53,19.22 180 top
R6  62.53,17.05 0 top
R7  39.74,14.49 90 top
R8  24.88,18.69 90 top
R9  12.95,18.67 270 top
R10  23.18,14.4 90 top
R11  23.17,10.95 270 top
R12  23.17,18.68 270 top
R13  38.06,14.5 270 top
R14  38.87,19.33 180 top
R15  38.2,3.69 270 top
R16  39.86,3.68 90 top
R17  81.04,16.15 0 top
R18  23.17,6.7 270 top
R19  34.74,14.5 90 top
R20  36.39,14.5 90 top
R21  49.62,7.95 270 top
R22  49.64,3.88 270 top
R23  47.95,3.89 270 top
R24  47.93,7.93 270 top
R25  81.04,34.01 0 top
R26  46.25,3.86 90 top
R27  57.82,7.95 90 top
R38  66.45,43.06 270 top
R39  63.91,43.08 270 top
R40  55.69,12.27 270 top
R46  16.24,18.67 90 top
R47  14.59,18.67 90 top
S3  31.47,2.64 0 top
SW1  54,18.37 180 top
SW2  71,18.37 180 top
U1  33,34 90 top
U2  43.09,14.62 180 top
U3  43.1,3.88 90 top
U4  53.82,5.96 0 top
U5  31.86,14.5 180 top
U$11  63,36 0 top
U$24  16.76,12.5 180 top
X1  46,25 0 bottom
X2  9.5,12.5 90 top
X6  16.66,2.01 90 top

### Tracks (layer width: path | path; a pad name or v marks a point on that pad's centre or on a via)
3V3  (via drill 0.35)
  Top 0.406: FB1.1 14.13,30.01 | 14.13,30.01 14.13,31.82 C2.2 v13.95,33.52 v13.94,33.53 | C1.1 14.1,30.04 14.13,30.01 | v22.17,40.41 22.19,40.43 U1.2
  Bottom 0.406: v13.94,33.53 13.94,36.31 18.07,40.44 22.14,40.44 v22.17,40.41
+3V3  (via drill 0.35)
  Top 0.203: v24.88,20.92 v24.87,20.93 | R12.1 R8.2 | R5.1 63.38,18.6 62.93,18.15 62.04,18.15 61.68,17.79 R6.1 61.68,15.41 61.05,14.79 | 61.05,14.79 60.82,14.55 | 61.05,14.79 61.05,14.54 60.95,14.43 | R38.2 63.93,42.21 R39.2 v62.86,42.23 | 58.83,42.2 58.86,42.23
  Top 0.305: U$11.VCC 58.83,42.2 58.83,39.45 61.9,36.38 61.9,29.3 58.96,26.36 v58.96,22.61
  Top 0.406: R8.2 v24.88,20.92 | FB1.2 v14.13,26.96 | v12.94,34.11 11.7,34.11 8.05,30.46 v8.05,27.88 | IC1.2 62.55,9.07 62.55,10.14 61.44,11.25 C10.+ 61.44,13.93 60.95,14.43 60.82,14.55 v59.09,14.55 56.15,14.55 55.69,14.09 R40.1 | v24.87,20.93 v24.88,20.92 35.29,20.92 v35.32,20.95
  Bottom 0.203: v62.86,42.23 62.86,45.4 62.49,45.77 59.3,45.77 58.83,46.24 U$11.VCC
  Bottom 0.305: v58.96,22.61 58.96,14.68 v59.09,14.55
  Bottom 0.406: JP2.6 4.71,10.31 9.12,5.9 17.24,5.9 17.9,6.56 17.9,20.63 | 17.9,21.25 17.9,23.19 v14.13,26.96 13.21,27.88 v8.05,27.88 | 17.9,21.25 17.9,20.91 | 17.9,20.91 17.9,20.63 | 17.9,20.91 17.92,20.93 18.2,20.93 | v24.87,20.93 18.22,20.93 | 17.9,21.25 18.22,20.93 | 18.22,20.93 18.2,20.93 | 18.2,20.93 17.9,20.63 | J1.1 13.71,37.66 12.94,36.89 v12.94,34.11 | v35.32,20.95 44.22,20.95 50.62,14.55 v59.09,14.55
+5V  (via drill 0.35, 0.5)
  Top 0.203: R7.1 v39.74,12.38 | 37.01,19.33 R14.2 | 44.07,17.86 C8.1 48.1,17.7 | 47.95,11.09 48.09,11.09 47.93,10.93 47.77,11.09 47.95,11.09 | 47.93,11.07 47.95,11.09 | C7.1 47.9,11.14 47.95,11.09 | U2.4 44.87,15.12 45.12,14.87 44.87,14.62 U2.3
  Top 0.254: U2.4 44.52,14.87 U2.3
  Top 0.305: v46.13,14.87 46.09,14.87 | 44.52,14.87 44.78,14.87
  Top 0.406: 46.09,14.87 44.78,14.87 | C7.1 46.86,11.37 46.13,12.1 v46.13,14.87 47.51,14.87 48.1,15.46 48.1,17.7 v48.1,27.37 v48.09,27.38 | C7.1 C6.1 C5.1 | C7.1 47.9,8.81 R24.1 v46.89,8.78 v46.88,8.77 | C5.1 51.91,11.13 U4.8 | C5.1 v53.47,11.37 v53.48,11.36 | v60.66,6.9 60.66,8.62 IC1.3 | v36.86,19.34 37,19.34 37.01,19.33 | 59.58,29.41 60.81,29.41 61.16,29.76 61.16,31.96 | 59.58,29.41 IC2.24 | 61.16,31.96 61.1,32.02 IC2.20 IC2.19 | 61.16,31.96 61.16,35.98 60.58,36.56 IC2.13 IC2.14 | v59.51,28.58 59.51,29.34 59.58,29.41
  Bottom 0.406: v53.48,11.36 59.15,11.36 60.66,9.85 v60.66,6.9 | v46.13,14.87 46.13,15.53 46.13,15.54 46.13,16.99 45.64,17.47 | 45.64,17.47 45.62,17.49 | v39.74,12.38 39.74,17.08 | 39.74,17.08 39.74,17.53 | 39.74,17.53 39.74,17.85 | 39.74,17.85 39.74,18.35 38.75,19.34 v36.86,19.34 | 39.74,17.53 39.8,17.47 40.12,17.47 | 45.64,17.47 40.13,17.47 | 40.13,17.47 40.12,17.47 | 40.12,17.47 39.74,17.85 | 40.13,17.47 39.74,17.08 | JP1.3 JP1.4 5.69,38.03 4.96,37.3 2.16,37.3 1.22,36.36 1.22,7.45 2.53,6.14 5.12,6.14 9.48,1.78 21.16,1.78 27.27,7.89 35.45,7.89 38.2,5.14 43.39,5.14 46.88,8.63 v46.88,8.77 | v48.09,27.38 58.94,27.38 59.51,27.95 v59.51,28.58
CHIP_PU  (via drill 0.35)
  Top 0.203: v15.55,27.96 15.52,27.99 v15.52,34.09 | v18.96,39.28 23.88,39.28 U1.3 | R12.2 23.17,17.26 23.92,16.51 v25.94,16.51 25.94,13.56 26.99,12.51 Q5.3
  Bottom 0.203: v15.55,27.96 16.3,27.96 21.06,23.2 24.44,23.2 25.94,21.7 v25.94,16.51 | v15.52,34.09 15.52,35.92 18.88,39.28 v18.96,39.28
DTR
  Top 0.203: U$24.13 17.39,11.2 18.4,12.2 22.77,12.2 R11.1 24.87,13.5 Q6.2
GND  (via drill 0.35)
  Top 0.203: X2.P$2 10.35,13.72 C25.1 10.35,16.26 9.75,16.86 v9.5,16.86 9.5,19.04 10.19,19.73 LED1.C | 8.6,11.32 X2.P$4 | v7.3,9.35 C24.1 8.65,9.55 8.64,9.54 8.64,9.18 8.64,9.1 | U$24.1 21.2,14.21 20.3,13.3 v14.45,13.3 | R19.2 34.15,15.35 33.3,14.5 32.2,14.5 31.86,14.84 U5.2 | R13.2 38.06,12.57 v38.04,12.55 | C3.1 36.71,17.68 35.38,19.01 v34.41,19.01 | U2.11 v43.09,14.09 v43.08,14.08 | R18.2 20.39,5.85 20.34,5.9 | U3.2 43.1,3.77 | 43.1,3.77 42.94,3.93 40.46,3.93 R16.2 39.76,4.63 39.76,8.26 39.13,8.89 v38.04,8.89 | 43.1,3.77 43.26,3.93 44.66,3.93 45.44,4.71 R26.2 46.25,6 v46.23,6.02 | R23.2 R22.2 v50.73,3.03 | U4.4 55.75,3.38 v55.75,5.14 56.55,5.94 56.55,8.47 56.88,8.8 R27.2 | LED6.C 58.98,13.38 v59.09,13.27 | R15.2 37.2,2.84 36.71,3.33 36.71,8.89 | R4.2 18.5,33.48 v18.53,33.51 | v12.06,33.24 12.06,32.16 11.9,32 | SW1.B2 C6.2 50.14,13.15 | SW2.B2 65.11,16.12 64.5,15.51 C10.-
  Top 0.254: X6.GND 17.96,2.77 17.2,2.01
  Top 0.305: U$11.GND 61.37,38.35 v64.78,34.94
  Top 0.406: JP2.7 8.57,7.77 C27.1 8.64,3.03 9.66,2.01 X6.SHIELD1 | 32.95,38.16 29.41,41.7 U1.1 16.27,41.7 15.97,42 J1.2 | 32.95,38.16 33,38.11 U1.GND v33.01,33.17 v33.01,28.34 32.9,28.23 27.96,28.23 27.29,27.55 U1.15 | U1.38 36.48,41.7 32.95,38.16 | C1.2 11.95,25.07 11.88,25 | X1.M 9.75,30.78 10.97,32 11.9,32 C2.1 v12.05,33.23 v12.06,33.24 | C4.2 36.71,8.89 v38.04,8.89 | C7.2 C6.2 | C6.2 50.49,13.27 50.61,13.15 50.14,13.15 C6.2 | C6.2 C5.2 v53.47,13.27 | C10.- 65.26,11.21 IC1.1 65.26,6.9 v65.28,6.88 | IC2.18 57.45,33.31 v57.33,33.2 | IC2.4 65.06,31.36 v64.71,31.01 65,30.71 IC2.3 | IC2.10 65.11,35.27 v64.78,34.94 65.11,34.62 IC2.9
  Top 0.508: X6.SHIELD1 X6.SHIELD3 17.2,2.01 X6.SHIELD2 20.34,5.9 20.34,6.67 v20.32,6.69 | U5.2 31.86,16.91 32.81,17.86 C9.2 v34.4,19 v34.41,19.01 | X1.M 11.88,25 16.29,25 17.9,23.39 C26.1 | v6.69,11.47 8.46,11.47 8.6,11.32 8.65,11.28 C24.1 | 8.57,9.24 8.64,9.18 | C27.1 8.64,9.1
  Bottom 0.203: v9.5,16.86 10.35,16.01 10.35,13.5 | 10.35,13.5 10.35,13.35 | 10.35,13.35 10.35,13.1 | 10.35,13.1 10.35,10.95 8.75,9.35 v7.3,9.35 | 10.35,13.35 10.4,13.3 10.55,13.3 | v14.45,13.3 10.55,13.3 | 10.35,13.5 10.55,13.3 | 10.55,13.3 10.35,13.1 | 34.39,12.37 34.36,12.4 | v38.04,12.55 38.04,12.52 | v55.75,5.14 55.75,3.86 54.92,3.03 v50.73,3.03 48.11,3.03 46.23,4.91 v46.23,6.02 | v18.53,33.51 18.53,31.95 | v33.01,28.34 32.77,28.1 22.38,28.1 18.53,31.95 | 18.53,31.95 12.69,31.95 12.06,32.58 v12.06,33.24
  Bottom 0.406: J1.2 12.62,42 12.58,42.04 | 12.33,42.29 10.42,44.2 3.93,44.2 3.15,43.42 JP1.5 JP1.6 | 12.33,42.29 12.58,42.04 | 43.08,13.01 43.08,12.37 42.18,11.47 39.12,11.47 v38.04,12.55 | 43.08,13.01 43.08,13.3 | 43.08,13.3 43.08,13.53 | 43.08,13.53 v43.08,14.08 | 38.04,12.52 34.36,12.52 | v38.04,8.89 36.75,10.18 34.36,10.18 | 43.34,13.27 v53.47,13.27 v59.09,13.27 63.22,13.27 65.28,11.21 v65.28,6.88 | 43.34,13.27 43.11,13.27 43.08,13.3 | 43.34,13.27 43.08,13.01 | 43.34,13.27 43.08,13.53 | 61.23,33.2 v57.33,33.2 33.04,33.2 v33.01,33.17 | v64.71,31.01 63.42,31.01 61.23,33.2 | 61.23,33.2 62.98,34.95 v64.77,34.95 v64.78,34.94 | v12.06,33.24 12.06,41.52 12.33,41.79 | 12.33,41.79 12.58,42.04 | 12.33,42.29 12.33,41.79
  Bottom 0.508: v34.41,19.01 34.36,19.06 34.36,12.52 34.36,12.4 34.36,10.18 33.01,8.83 21.64,8.83 20.33,7.52 v20.33,6.7 v20.32,6.69 | X1.M 7.33,25 5.54,23.21 5.54,12.62 v6.69,11.47
  other vias: 43.09,15.2 47,37 48,37 49,37 47,36 48,36 49,36 47,35 48,35 49,35 55,44 56,44 57,44 55,43 56,43 57,43 55,42 56,42 57,42 52,44 53,44 54,44 52,43 53,43 54,43 52,42 53,42 54,42 49,44 50,44 51,44 49,43 50,43 51,43 49,42 50,42 51,42 45,25 46,25 47,25 45,24 46,24 47,24 45,23 46,23 47,23 61,25 62,25 63,25 64,25 65,25 61,24 61,23 61,22 62,24 62,23 62,22 63,24 64,24 65,24 63,23 64,23 65,23 63,22 64,22 65,22 72,35 73,35 74,35 75,35 76,35 72,34 72,33 72,32 73,34 73,33 73,32 74,34 75,34 76,34 74,33 75,33 76,33 74,32 75,32 76,32 72,31 73,31 74,31 75,31 76,31 72,30 72,29 72,28 73,30 73,29 73,28 74,30 75,30 76,30 74,29 75,29 76,29 74,28 75,28 76,28 73,11 73,10 74,11 74,10 75,11 76,11 77,11 75,10 76,10 77,10 32,35 33,35 34,35 32,34 33,34 34,34 32,33 33,33 34,33 32,36 33,36 34,36 32,32 33,32 34,32 31,35 31,34 31,33 31,36 31,32 35,35 35,34 35,33 35,36 35,32 28,19 29,19 28,18 29,18 28,17 29,17 24.5,2.7 25.5,2.7 24.5,1.7 25.5,1.7 8.5,18.9 9.5,18.9 8.5,17.9 9.5,17.9 8.5,16.9 7.5,18.9 7.5,17.9 7.5,16.9 22.2,30.7 22.2,29.7 21.3,30.2 64.9,4.9 64.9,5.9 65.9,4.9 65.9,5.9 61.9,4.9 61.9,5.9 62.9,4.9 62.9,5.9 63.9,4.9 63.9,5.9 6.2,48.3 7.2,48.3 8.2,48.3 6.2,47.3 7.2,47.3 8.2,47.3 6.2,46.3 7.2,46.3 8.2,46.3 9.2,48.3 10.2,48.3 11.2,48.3 9.2,47.3 10.2,47.3 11.2,47.3 9.2,46.3 10.2,46.3 11.2,46.3 6.2,45.3 7.2,45.3 8.2,45.3 9.2,45.3 10.2,45.3 11.2,45.3 6.2,44.3 7.2,44.3 8.2,44.3 9.2,44.3 10.2,44.3 11.2,44.3 25.9,25 25.9,24
  pour Bottom (isolate 0.406): 86,47.28 86,3.12 arc-90 82.81,-0.07 2.99,-0.07 arc-90 0.04,2.88 0.04,47.01 arc-90 3.03,50 83.28,50 arc-90
  pour Top (isolate 0.406): 86,47.47 86,3.24 arc-90 82.76,0 2.88,0 arc-90 0.01,2.87 0.01,46.78 arc-90 3.22,49.99 83.48,49.99 arc-90
GPIO0
  Top 0.203: U1.25 42,22.38 40.03,20.41 36.4,20.41 35.94,19.95 34.77,19.95 34.43,20.29 27.82,20.29 26.99,19.46 26.99,17.76 | Q6.3 26.99,17.76 | 26.99,17.76 26.91,17.84 R8.1
GPIO2/LED  (via drill 0.35)
  Top 0.203: R9.1 v12.95,21.01 | U1.24 38.72,22.66 38.37,22.31 22.36,22.31 v22.34,22.33 | v15.47,26.78 15.47,26.15 15.25,25.93 12.99,25.93 v12.95,25.97
  Bottom 0.203: v22.34,22.33 19.89,22.33 15.47,26.75 v15.47,26.78 | v12.95,25.97 v12.95,21.01
GPIO4/SW1
  Top 0.203: R5.2 51.42,19.22 SW1.A2 49.72,20.93 49.72,27.32 48.91,28.13 45.05,28.13 43.38,26.46 U1.26
GPIO5/SW2
  Top 0.203: R6.2 64.65,17.05 67.03,19.43 SW2.A2 61.08,20.62 60.13,19.67 53.33,19.67 50.19,22.81 50.19,24.22 50.19,29 48.92,30.27 U1.29
GPIO12  (via drill 0.35)
  Top 0.203: v21.8,25.25 23.94,25.25 U1.14
  Bottom 0.203: JP3.1 4.54,26.69 6.5,28.65 16.35,28.65 19.75,25.25 v21.8,25.25
GPIO13  (via drill 0.35)
  Top 0.203: v28.54,25.35 28.54,23.71 U1.16
  Bottom 0.203: JP3.2 16.65,29.23 19.93,25.95 27.94,25.95 v28.54,25.35
GPIO14  (via drill 0.35)
  Top 0.203: v20.2,26.7 20.43,26.46 U1.13
  Bottom 0.203: JP3.3 4.53,31.77 6.55,29.75 17.14,29.75 v20.2,26.7
GPIO15  (via drill 0.35)
  Top 0.203: U1.23 37.45,24.51 36.77,25.18 v29.81,25.18
  Bottom 0.203: JP3.4 7.08,30.35 17.5,30.35 21.45,26.4 28.59,26.4 v29.81,25.18
GPIO16/SERVO1  (via drill 0.35)
  Top 0.203: v39.86,27.89 40.02,27.73 U1.27
  Bottom 0.203: JP1.1 9.69,40.34 9.69,32.89 11.1,31.48 18.11,31.48 21.97,27.62 39.59,27.62 v39.86,27.89
GPIO17/SERVO2  (via drill 0.35)
  Top 0.203: v40.65,29 U1.28
  Bottom 0.203: JP1.2 8.23,33.28 10.56,30.95 17.8,30.95 21.6,27.15 40.22,27.15 40.65,27.58 v40.65,29
GPIO18/A2
  Top 0.203: U1.30 51.37,31.54 53.8,33.97 IC2.17
GPIO19/B2
  Top 0.203: U1.31 52.01,32.81 53.81,34.62 IC2.16
GPIO22/PWM2
  Top 0.203: U1.37 48.65,40.43 53.81,35.27 IC2.15
GPIO25/A1  (via drill 0.35)
  Top 0.203: U1.10 v26.35,30.27 | IC2.21 57.59,31.36 v57.22,31.74
  Bottom 0.203: v26.35,30.27 38.93,30.27 39.84,31.18 56.66,31.18 v57.22,31.74
GPIO26/B1  (via drill 0.35)
  Top 0.203: U1.11 v26.36,29 v26.37,28.99 | IC2.22 v57.24,30.71 v57.24,30.72
  Bottom 0.203: v26.37,28.99 27.07,29.69 39.1,29.69 40.13,30.72 v57.24,30.72
GPIO27/PWM1  (via drill 0.35)
  Top 0.203: U1.12 26.41,27.73 27.64,28.96 v27.71,28.96 | v57.29,29.69 57.66,30.07 IC2.23
  Bottom 0.203: v27.71,28.96 27.9,29.15 39.23,29.15 40.38,30.3 56.68,30.3 v57.29,29.69
GPIO32/ADC1_4
  Top 0.203: U1.8 22.85,32.81 20.78,34.88 11.41,34.88 7.3,30.77 7.3,21.9 5.87,20.47 5.87,15.6 JP2.5
GPIO33/VBATT
  Top 0.203: R3.2 R4.1 19.68,30.49 20.73,31.54 U1.9
GPIO34/ADC1_6
  Top 0.203: U1.6 22.45,35.35 21.79,36.01 10.78,36.01 6.3,31.53 6.3,22.6 4.52,20.82 4.52,19.33 JP2.3
GPIO35/ADC1_7
  Top 0.203: U1.7 22.58,34.08 21.19,35.47 11.2,35.47 6.8,31.07 6.8,22.2 5.32,20.72 5.32,17.59 JP2.4
GPIO36/ADC1_0
  Top 0.203: JP2.1 4.81,23.01 5.35,23.55 5.35,32.28 10.96,37.89 U1.4
GPIO39/ADC1_3
  Top 0.203: JP2.2 3.37,20.47 5.8,22.9 5.8,31.88 10.54,36.62 U1.5
N$1
  Top 0.203: U3.6 42.16,6.76 41.7,7.22 41.7,9.88 L1.1 | S3.2 32.89,2.64 32.47,3.06 32.46,3.07 32.33,3.2 Q4.2
  Top 0.254: U2.10 41.66,10.29 L1.1
  Top 0.406: D1.C 35.5,10.31 | 37.3,10.31 41.63,10.31 41.66,10.29 | 37.3,10.31 35.5,10.31 | 35.5,10.31 35.98,10.79 C4.1 36.82,10.79 37.3,10.31
  Top 0.508: Q4.2 32.33,6.63 33.45,7.75 D1.C
N$2
  Top 0.203: C3.2 40.39,17.68 41.35,18.64 42.82,18.64 43.06,18.4 43.06,17.01 42.91,16.86 42.02,16.86 41.66,16.5 U2.6
N$3
  Top 0.203: U2.1 U2.2
  Top 0.305: U2.1 44.52,9.98 L1.2
N$4  (via drill 0.35)
  Top 0.203: U2.9 40.88,14.12 40.63,13.87 40.63,11.83 40.05,11.25 v38.07,11.25 | v43.11,6.28 U3.5 | R15.1 38.2,6.26 v38.23,6.29
  Bottom 0.203: v38.23,6.29 39.04,6.29 | 39.04,6.29 39.23,6.29 | 39.23,6.29 39.43,6.29 | 39.43,6.29 v43.1,6.29 v43.11,6.28 | 39.23,6.48 39.23,9.17 38.07,10.33 v38.07,11.25 | 39.23,6.48 39.23,6.29 | 39.04,6.29 39.23,6.48 | 39.23,6.48 39.24,6.48 39.43,6.29
N$5
  Top 0.203: U2.7 40.9,15.12 40.68,15.34 | R13.1 R7.2 40.68,15.34 | C8.2 41.14,17.7 40.68,17.24 40.68,15.34
N$6  (via drill 0.35)
  Top 0.203: U2.5 45.48,15.62 45.76,15.9 46.98,15.9 v47.05,15.83 | v41.09,19.33 R14.1
  Bottom 0.203: v47.05,15.83 47.05,17.08 45.99,18.14 41.48,18.14 41.09,18.53 v41.09,19.33
N$7  (via drill 0.35)
  Top 0.203: U3.1 42.08,2.68 v41.1,2.68 40.01,2.68 R16.1
  Bottom 0.203: v41.1,2.68 38.28,2.68 36.72,1.12 30.49,1.12 S3.1
N$8
  Top 0.203: R21.2 49.62,6.09 | 49.62,6.09 49.62,5.87 | 49.62,5.87 49.62,5.73 | 49.62,5.73 49.62,4.75 R22.1 | 49.62,5.87 49.8,5.87 | 49.8,5.87 52.38,5.87 53.19,5.07 U4.2 | 49.62,6.09 49.8,5.91 | 49.8,5.87 49.8,5.91 | 49.8,5.91 49.62,5.73
N$9  (via drill 0.35)
  Top 0.203: R24.2 v47.93,5.91 47.93,4.76 R23.1 | v54.45,5.91 U4.3
  Bottom 0.203: v47.93,5.91 v54.45,5.91
N$10
  Top 0.203: U3.3 44.98,2.76 45.23,3.01 R26.1 46.25,1.61 46.53,1.33 51.44,1.33 51.77,1.66 51.8,1.69 | U4.1 51.91,1.8 51.91,1.79 | 51.91,1.79 51.8,1.69 | LED8.A 57.82,1.81 57.33,1.32 52.38,1.32 52.01,1.69 | 52.01,1.69 51.91,1.79 | 51.8,1.69 52.01,1.69
N$11
  Top 0.203: LED3.C LED4.A 79.99,16.35 R17.1
N$12
  Top 0.203: LED5.C LED7.A 79.99,33.81 R25.1
N$13
  Top 0.203: R19.1 33.81,13.65 33.36,13.2 U5.5
N$14
  Top 0.203: U$24.8 12.31,13.16 11.7,12.55 9,12.55 8.57,12.97 X2.P$3 8.65,13.72 C25.2
N$15
  Top 0.203: LED2.C 30.06,14.58 31.19,14.58 31.86,13.91 31.86,12.52 32.24,12.14 36.18,12.14 36.41,12.37 36.41,13.63 R20.1
N$16
  Top 0.203: R20.2 36.39,16.33 36.27,16.45 33.93,16.45 33.28,15.8 U5.1
N$17
  Top 0.203: U$24.7 13.59,12.63 12.3,11.35 10.6,11.35 | 10.6,11.35 X2.P$1 | C24.2 10.35,11.1 10.6,11.35
N$18  (via drill 3.1)
  other vias: 3,3
N$19  (via drill 3.1)
  other vias: 83,3
N$20  (via drill 3.1)
  other vias: 83,47
N$21  (via drill 3.1)
  other vias: 3,47
N$22
  Top 0.203: LED8.C R27.1
N$23
  Top 0.203: LED1.A 11.23,17.82 R9.2
N$35
  Top 0.203: LED6.A 55.83,11.28 R40.2
N$38
  Top 0.203: Q5.1 23.17,10.12 R11.2
N$40
  Top 0.203: U$24.4 17.39,16.14 17.9,16.65 C26.2
N$41
  Top 0.203: R10.2 24.74,15.25 Q6.1
N$52
  Top 0.203: U$24.2 19.93,15.94 21.2,17.2 R2.1
N$53
  Top 0.203: U$24.3 18.66,16.02 19.55,16.9 R1.1
N$64
  Top 0.203: U$24.5 16.12,16.43 16.35,16.65 16.35,17.71 R46.1
N$65
  Top 0.203: U$24.6 14.86,16.45 14.59,16.71 R47.1
OUTA1
  Top 0.203: J3.2 82.88,8.55 83.68,9.35 83.68,16.35 LED4.C LED3.A
  Top 0.406: IC2.2 IC2.1 68.03,29.41 69.37,28.07 69.37,10.93 71.75,8.55 J3.2
OUTA2  (via drill 0.35)
  Top 0.203: LED5.A LED7.C 83.23,32.23 v83.25,32.21
  Top 0.406: IC2.7 IC2.8 68.73,33.97 72.21,37.44 J4.2
  Bottom 0.203: v83.25,32.21 83.25,36.48 82.29,37.44 J4.2
OUTB1
  Top 0.203: R17.2 81.89,14.71 81.04,13.86 J3.1
  Top 0.406: IC2.5 IC2.6 68.52,32.66 70.19,30.99 70.19,14.24 72.38,12.05 J3.1
OUTB2
  Top 0.203: R25.2 83.28,35.4 83.28,39.71 82.05,40.94 J4.1
  Top 0.406: IC2.11 IC2.12 69.25,36.56 73.62,40.94 J4.1
RTS  (via drill 0.35)
  Top 0.203: v22.1,13.65 23.08,13.65 R10.1 | v25.95,9.95 Q5.2 | U$24.14 18.66,11.27 v18.86,11.46
  Bottom 0.203: 22.1,11.47 v18.87,11.47 v18.86,11.46 | 22.1,11.47 v22.1,13.65 | 22.1,11.47 22.1,10.74 22.89,9.95 v25.95,9.95
RX  (via drill 0.35)
  Top 0.203: R2.2 21.2,22 16.84,26.36 v16.84,34.08 | v39.86,36.63 U1.34
  Bottom 0.203: v16.84,34.08 16.84,35.11 20.48,38.75 37.73,38.75 v39.85,36.63 v39.86,36.63
SCL  (via drill 0.35)
  Top 0.203: U1.36 42.04,39.2 v43.61,39.2 | U$11.SCL R39.1
  Bottom 0.203: U$11.SCL 63.91,41.63 61.48,39.2 v43.61,39.2 41.09,39.2 39.92,40.37 24.36,40.37 23.03,41.7 16.7,41.7 15.1,43.3 15.1,44.89 14.03,45.96 J1.4
SDA  (via drill 0.35)
  Top 0.203: U1.33 43.16,35.35 43.63,35.82 v43.63,38.06 | U$11.SDA R38.1
  Bottom 0.203: U$11.SDA 66.45,43.41 61.8,38.76 45.31,38.76 44.61,38.06 v43.63,38.06 41.55,38.06 39.68,39.93 24.04,39.93 22.69,41.28 16.43,41.28 J1.3
TX  (via drill 0.35)
  Top 0.203: R1.2 19.55,22.99 16.35,26.19 16.35,32.99 v16.18,33.16 | v39.94,37.98 40.03,37.89 U1.35
  Bottom 0.203: v16.18,33.16 16.18,35.26 20.18,39.26 38.66,39.26 v39.94,37.98
USB_N  (via drill 0.35)
  Top 0.254: R47.2 14.59,20.58 15.21,21.2 15.21,22.4 v14.96,22.65 | v15.9,6.8 16.15,6.55 16.15,5.9 16.01,5.76 X6.D-
  Bottom 0.254: v14.96,22.65 15.21,22.4 15.21,13.11 16.15,12.18 16.15,7.05 v15.9,6.8
USB_P  (via drill 0.35)
  Top 0.254: R46.2 16.24,20.58 15.62,21.2 15.62,22.4 v15.87,22.65 | v16.81,6.8 16.56,6.55 16.56,5.9 16.66,5.8 X6.D+
  Bottom 0.254: v15.87,22.65 15.62,22.4 15.62,13.28 16.56,12.34 16.56,7.05 v16.81,6.8
VBAT  (via drill 0.35, 0.5)
  Top 0.203: R21.1 49.62,9.97 v49.65,10 | 31.28,4.55 v31.37,4.46 v31.38,4.47 Q4.3 | R3.1 18.51,25.37 19.63,24.25 v21.81,24.25
  Top 0.508: U5.3 v30.91,17.17 v30.9,17.18 C9.1 | v31.4,10.96 v31.39,10.97
  Top 0.61: v31.39,10.97 Q4.3
  Bottom 0.203: v49.65,10 49.65,7.64 48.97,6.96 46.06,6.96 43.59,4.49 37.98,4.49 35.45,7.02 32.23,7.02 31.37,6.16 v31.37,4.46 | v21.81,24.25 24.09,24.25 27.25,21.09 30.66,21.09 | 30.67,21.09 30.9,21.09 | 30.9,21.33 30.66,21.09 | 30.66,21.09 30.67,21.09 | 30.67,21.09 30.9,20.86
  Bottom 0.508: X1.P 77.48,25 76.12,26.36 32.64,26.36 30.9,24.62 30.9,21.33 30.9,21.09 30.9,20.86 v30.9,17.18 30.9,13.99 31.39,13.5 v31.39,10.97
VBUS
  Top 0.203: C27.2 14.4,7.7 | 14.4,7.7 14.65,7.7 14.7,7.75 | 14.4,7.7 14.7,7.4 | 22.77,7.95 R18.1 23.17,8.08 23.19,8.1 | 29.41,8.76 29.39,8.76
  Top 0.508: X6.VBUS 15.36,5.74 14.7,6.4 14.7,7.4 14.7,7.75 15.05,8.1 20.9,8.1 | 20.9,8.1 21.2,8.1 | 21.2,8.1 21.55,8.1 | 21.55,8.1 23.19,8.1 28.9,8.1 29,8.1 | U$24.16 21.2,8.45 | 21.2,8.4 21.2,8.11 21.2,8.1 | 21.2,8.45 21.2,8.4 | 21.2,8.4 20.9,8.1 | 21.2,8.45 21.55,8.1 | 29.21,12.58 29.21,10.49 D1.A 29.39,8.76 29.39,8.5 | 29.21,12.58 29.83,13.2 | U5.4 29.83,13.2 | 29.21,12.58 29.21,13.33 LED2.A 29.58,13.45 29.83,13.2 | 29,8.1 29.4,8.1 | 29.4,8.1 30.43,7.07 Q4.1 | 29.39,8.5 29.39,8.11 29.4,8.1 | 29.39,8.5 29,8.1

### Text on the board
tPlace: I2C | SCL | GND | SDA | +5V | IO16 | GND | 3V3 | SERVO | GND | M2 | +5V | IO17 | IO15 | IO14 | GPIO | IO13 | IO12 | IO36 | IO39 | IO34 | IO35 | IO32 | 3V3 | ANALOG INPUT | M1 | GND | MICROTECHBEING | MTB | MR32-BOT | POWER